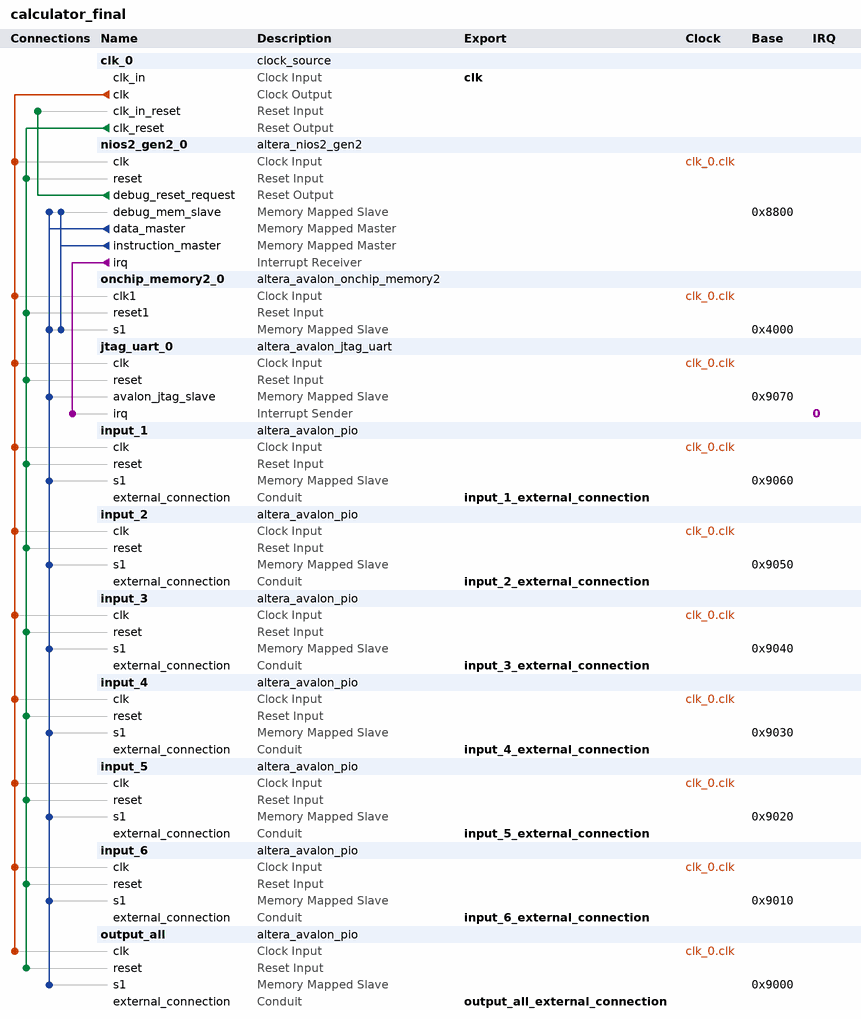
[diagram p0: system contents]
# Platform Designer (Qsys) system calculator_final, Cyclone IV E EP4CE115F29C7
# Parameters at their usual value, and those the tool derives, are not listed.
package require -exact qsys 14.1
create_system calculator_final
set_project_property DEVICE_FAMILY {Cyclone IV E}
set_project_property DEVICE EP4CE115F29C7

add_instance clk_0 clock_source 14.1
set_instance_parameter_value clk_0 clockFrequency 50000000

add_instance nios2_gen2_0 altera_nios2_gen2 14.1
set_instance_parameter_value nios2_gen2_0 dcache_size 2048
set_instance_parameter_value nios2_gen2_0 exceptionSlave onchip_memory2_0.s1
set_instance_parameter_value nios2_gen2_0 icache_size 4096
set_instance_parameter_value nios2_gen2_0 impl Fast
set_instance_parameter_value nios2_gen2_0 resetSlave onchip_memory2_0.s1

add_instance onchip_memory2_0 altera_avalon_onchip_memory2 14.1
set_instance_parameter_value onchip_memory2_0 dataWidth 32
set_instance_parameter_value onchip_memory2_0 dualPort false
set_instance_parameter_value onchip_memory2_0 initMemContent true
set_instance_parameter_value onchip_memory2_0 initializationFileName onchip_mem.hex
set_instance_parameter_value onchip_memory2_0 memorySize 16384

add_instance jtag_uart_0 altera_avalon_jtag_uart 14.1
set_instance_parameter_value jtag_uart_0 simInteractiveOptions NO_INTERACTIVE_WINDOWS

add_instance input_1 altera_avalon_pio 14.1
set_instance_parameter_value input_1 direction Input
set_instance_parameter_value input_1 width 4

add_instance input_2 altera_avalon_pio 14.1
set_instance_parameter_value input_2 direction Input
set_instance_parameter_value input_2 width 4

add_instance input_3 altera_avalon_pio 14.1
set_instance_parameter_value input_3 direction Input
set_instance_parameter_value input_3 width 1

add_instance input_4 altera_avalon_pio 14.1
set_instance_parameter_value input_4 direction Input
set_instance_parameter_value input_4 width 1

add_instance input_5 altera_avalon_pio 14.1
set_instance_parameter_value input_5 direction Input
set_instance_parameter_value input_5 width 1

add_instance input_6 altera_avalon_pio 14.1
set_instance_parameter_value input_6 direction Input
set_instance_parameter_value input_6 width 1

add_instance output_all altera_avalon_pio 14.1
set_instance_parameter_value output_all direction Output
set_instance_parameter_value output_all width 8

# connections
add_connection clk_0.clk input_1.clk clock
add_connection clk_0.clk input_2.clk clock
add_connection clk_0.clk input_3.clk clock
add_connection clk_0.clk input_4.clk clock
add_connection clk_0.clk input_5.clk clock
add_connection clk_0.clk input_6.clk clock
add_connection clk_0.clk jtag_uart_0.clk clock
add_connection clk_0.clk nios2_gen2_0.clk clock
add_connection clk_0.clk onchip_memory2_0.clk1 clock
add_connection clk_0.clk output_all.clk clock
add_connection clk_0.clk_reset input_1.reset reset
add_connection clk_0.clk_reset input_2.reset reset
add_connection clk_0.clk_reset input_3.reset reset
add_connection clk_0.clk_reset input_4.reset reset
add_connection clk_0.clk_reset input_5.reset reset
add_connection clk_0.clk_reset input_6.reset reset
add_connection clk_0.clk_reset jtag_uart_0.reset reset
add_connection clk_0.clk_reset nios2_gen2_0.reset reset
add_connection clk_0.clk_reset onchip_memory2_0.reset1 reset
add_connection clk_0.clk_reset output_all.reset reset
add_connection nios2_gen2_0.debug_reset_request clk_0.clk_in_reset reset
add_connection nios2_gen2_0.data_master input_1.s1 avalon
set_connection_parameter_value nios2_gen2_0.data_master/input_1.s1 baseAddress 0x9060
add_connection nios2_gen2_0.data_master input_2.s1 avalon
set_connection_parameter_value nios2_gen2_0.data_master/input_2.s1 baseAddress 0x9050
add_connection nios2_gen2_0.data_master input_3.s1 avalon
set_connection_parameter_value nios2_gen2_0.data_master/input_3.s1 baseAddress 0x9040
add_connection nios2_gen2_0.data_master input_4.s1 avalon
set_connection_parameter_value nios2_gen2_0.data_master/input_4.s1 baseAddress 0x9030
add_connection nios2_gen2_0.data_master input_5.s1 avalon
set_connection_parameter_value nios2_gen2_0.data_master/input_5.s1 baseAddress 0x9020
add_connection nios2_gen2_0.data_master input_6.s1 avalon
set_connection_parameter_value nios2_gen2_0.data_master/input_6.s1 baseAddress 0x9010
add_connection nios2_gen2_0.data_master jtag_uart_0.avalon_jtag_slave avalon
set_connection_parameter_value nios2_gen2_0.data_master/jtag_uart_0.avalon_jtag_slave baseAddress 0x9070
add_connection nios2_gen2_0.data_master nios2_gen2_0.debug_mem_slave avalon
set_connection_parameter_value nios2_gen2_0.data_master/nios2_gen2_0.debug_mem_slave baseAddress 0x8800
add_connection nios2_gen2_0.data_master onchip_memory2_0.s1 avalon
set_connection_parameter_value nios2_gen2_0.data_master/onchip_memory2_0.s1 baseAddress 0x4000
add_connection nios2_gen2_0.data_master output_all.s1 avalon
set_connection_parameter_value nios2_gen2_0.data_master/output_all.s1 baseAddress 0x9000
add_connection nios2_gen2_0.instruction_master nios2_gen2_0.debug_mem_slave avalon
set_connection_parameter_value nios2_gen2_0.instruction_master/nios2_gen2_0.debug_mem_slave baseAddress 0x8800
add_connection nios2_gen2_0.instruction_master onchip_memory2_0.s1 avalon
set_connection_parameter_value nios2_gen2_0.instruction_master/onchip_memory2_0.s1 baseAddress 0x4000
add_connection nios2_gen2_0.irq jtag_uart_0.irq interrupt
set_connection_parameter_value nios2_gen2_0.irq/jtag_uart_0.irq irqNumber 0

# exported interfaces
add_interface clk clock sink
set_interface_property clk EXPORT_OF clk_0.clk_in
add_interface input_1_external_connection conduit end
set_interface_property input_1_external_connection EXPORT_OF input_1.external_connection
add_interface input_2_external_connection conduit end
set_interface_property input_2_external_connection EXPORT_OF input_2.external_connection
add_interface input_3_external_connection conduit end
set_interface_property input_3_external_connection EXPORT_OF input_3.external_connection
add_interface input_4_external_connection conduit end
set_interface_property input_4_external_connection EXPORT_OF input_4.external_connection
add_interface input_5_external_connection conduit end
set_interface_property input_5_external_connection EXPORT_OF input_5.external_connection
add_interface input_6_external_connection conduit end
set_interface_property input_6_external_connection EXPORT_OF input_6.external_connection
add_interface output_all_external_connection conduit end
set_interface_property output_all_external_connection EXPORT_OF output_all.external_connection

set_interconnect_requirement {$system} qsys_mm.clockCrossingAdapter HANDSHAKE
set_interconnect_requirement {$system} qsys_mm.insertDefaultSlave FALSE
set_interconnect_requirement {$system} qsys_mm.maxAdditionalLatency 1

save_system calculator_final.qsys
